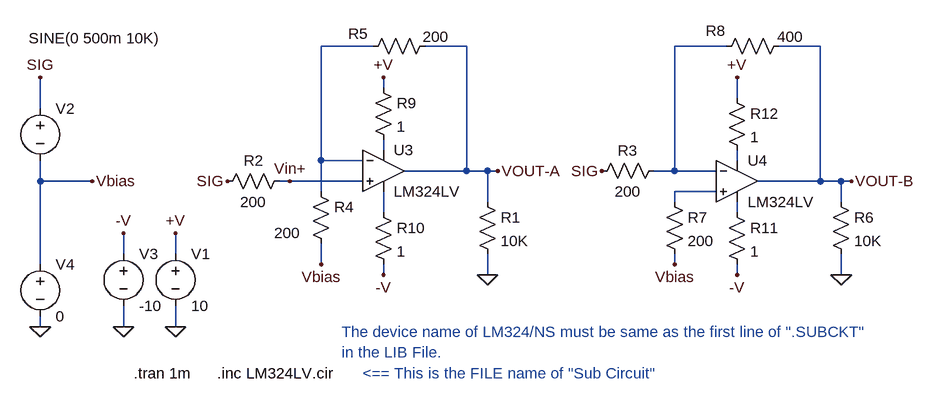
[diagram p0: schematic Fig_10-14_LM324LV_Test.asc]
Fig_10-14_LM324LV_Test.asc, the LTspice schematic file:
Version 4
SHEET 1 1396 804
WIRE 224 160 144 160
WIRE 368 160 304 160
WIRE 768 160 688 160
WIRE 912 160 848 160
WIRE 240 224 240 208
WIRE 784 240 784 208
WIRE -288 256 -288 208
WIRE 240 320 240 304
WIRE 144 336 144 160
WIRE 208 336 144 336
WIRE 784 336 784 320
WIRE 368 352 368 160
WIRE 368 352 272 352
WIRE 400 352 368 352
WIRE 416 352 400 352
WIRE 688 352 688 160
WIRE 688 352 656 352
WIRE 752 352 688 352
WIRE -288 368 -288 336
WIRE -208 368 -288 368
WIRE 96 368 80 368
WIRE 208 368 96 368
WIRE 912 368 912 160
WIRE 912 368 816 368
WIRE 944 368 912 368
WIRE 960 368 944 368
WIRE 144 384 144 336
WIRE 752 384 688 384
WIRE 400 400 400 352
WIRE 688 400 688 384
WIRE 944 400 944 368
WIRE 240 416 240 384
WIRE 784 416 784 400
WIRE -160 480 -160 448
WIRE -80 480 -80 448
WIRE -288 496 -288 368
WIRE 144 496 144 464
WIRE 688 496 688 480
WIRE 240 512 240 496
WIRE 400 512 400 480
WIRE 784 512 784 496
WIRE 944 512 944 480
WIRE -288 592 -288 576
WIRE -160 592 -160 560
WIRE -80 592 -80 560
FLAG -80 592 0
FLAG -80 448 +V
FLAG 240 208 +V
FLAG 960 368 VOUT-B
FLAG 784 208 +V
FLAG 416 352 VOUT-A
FLAG 96 368 Vin+
FLAG -288 208 SIG
FLAG -160 592 0
FLAG -160 448 -V
FLAG 240 512 -V
FLAG 784 512 -V
FLAG 576 352 SIG
FLAG 400 512 0
FLAG 944 512 0
FLAG 0 368 SIG
FLAG -288 592 0
FLAG -208 368 Vbias
FLAG 144 496 Vbias
FLAG 688 496 Vbias
SYMBOL voltage -80 464 R0
WINDOW 123 0 0 Left 2
WINDOW 39 0 0 Left 2
SYMATTR InstName V1
SYMATTR Value 10
SYMBOL voltage -288 240 R0
WINDOW 3 -18 -92 Left 2
WINDOW 123 -72 99 Left 2
WINDOW 39 0 0 Left 2
SYMATTR Value SINE(0 500m 10K)
SYMATTR InstName V2
SYMBOL res 96 352 R90
WINDOW 0 0 56 VBottom 2
WINDOW 3 32 56 VTop 2
SYMATTR InstName R2
SYMATTR Value 200
SYMBOL res 128 368 R0
WINDOW 3 -56 80 Left 2
SYMATTR Value 200
SYMATTR InstName R4
SYMBOL res 320 144 R90
WINDOW 0 12 119 VBottom 2
WINDOW 3 -14 -1 VTop 2
SYMATTR InstName R5
SYMATTR Value 200
SYMBOL res 864 144 R90
WINDOW 0 8 113 VBottom 2
WINDOW 3 -14 -2 VTop 2
SYMATTR InstName R8
SYMATTR Value 400
SYMBOL voltage -160 464 R0
WINDOW 123 0 0 Left 2
WINDOW 39 0 0 Left 2
SYMATTR InstName V3
SYMATTR Value -10
SYMBOL res 560 368 R270
WINDOW 0 32 56 VTop 2
WINDOW 3 0 56 VBottom 2
SYMATTR InstName R3
SYMATTR Value 200
SYMBOL res 384 384 R0
SYMATTR InstName R1
SYMATTR Value 10K
SYMBOL res 928 384 R0
SYMATTR InstName R6
SYMATTR Value 10K
SYMBOL res 672 384 R0
SYMATTR InstName R7
SYMATTR Value 200
SYMBOL res 224 208 R0
SYMATTR InstName R9
SYMATTR Value 1
SYMBOL res 224 400 R0
SYMATTR InstName R10
SYMATTR Value 1
SYMBOL res 768 400 R0
SYMATTR InstName R11
SYMATTR Value 1
SYMBOL res 768 224 R0
SYMATTR InstName R12
SYMATTR Value 1
SYMBOL voltage -288 480 R0
WINDOW 123 0 0 Left 2
WINDOW 39 0 0 Left 2
SYMATTR InstName V4
SYMATTR Value 0
SYMBOL Opamps\\opamp2 240 288 R0
SYMATTR InstName U3
SYMATTR Value LM324LV
SYMBOL Opamps\\opamp2 784 304 R0
SYMATTR InstName U4
SYMATTR Value LM324LV
TEXT -16 664 Left 2 !.inc LM324LV.cir
TEXT -144 664 Left 2 !.tran 1m
TEXT 208 664 Left 2 ;<== This is the FILE name of "Sub Circuit"
TEXT 176 600 Left 2 ;The device name of LM324/NS must be same as the first line of ".SUBCKT"\nin the LIB File.

The netlist it stands for:
* Fig_10-14_LM324LV_Test.asc
V1 +V 0 10
V2 SIG Vbias SINE(0 500m 10K)
R2 Vin+ SIG 200
R4 N001 Vbias 200
R5 VOUT-A N001 200
R8 VOUT-B N002 400
V3 -V 0 -10
R3 SIG N002 200
R1 VOUT-A 0 10K
R6 VOUT-B 0 10K
R7 N005 Vbias 200
R9 +V N003 1
R10 N006 -V 1
R11 N007 -V 1
R12 +V N004 1
V4 Vbias 0 0
XU3 Vin+ N001 N003 N006 VOUT-A LM324LV  ; pins In+ In- V+ V- OUT
XU4 N005 N002 N004 N007 VOUT-B LM324LV  ; pins In+ In- V+ V- OUT
.inc LM324LV.cir
.tran 1m
* <== This is the FILE name of "Sub Circuit"
* The device name of LM324/NS must be same as the first line of ".SUBCKT"
* in the LIB File.
.backanno
.end